# EAGLE schematic Paperduino (EAGLE 7.2.0)
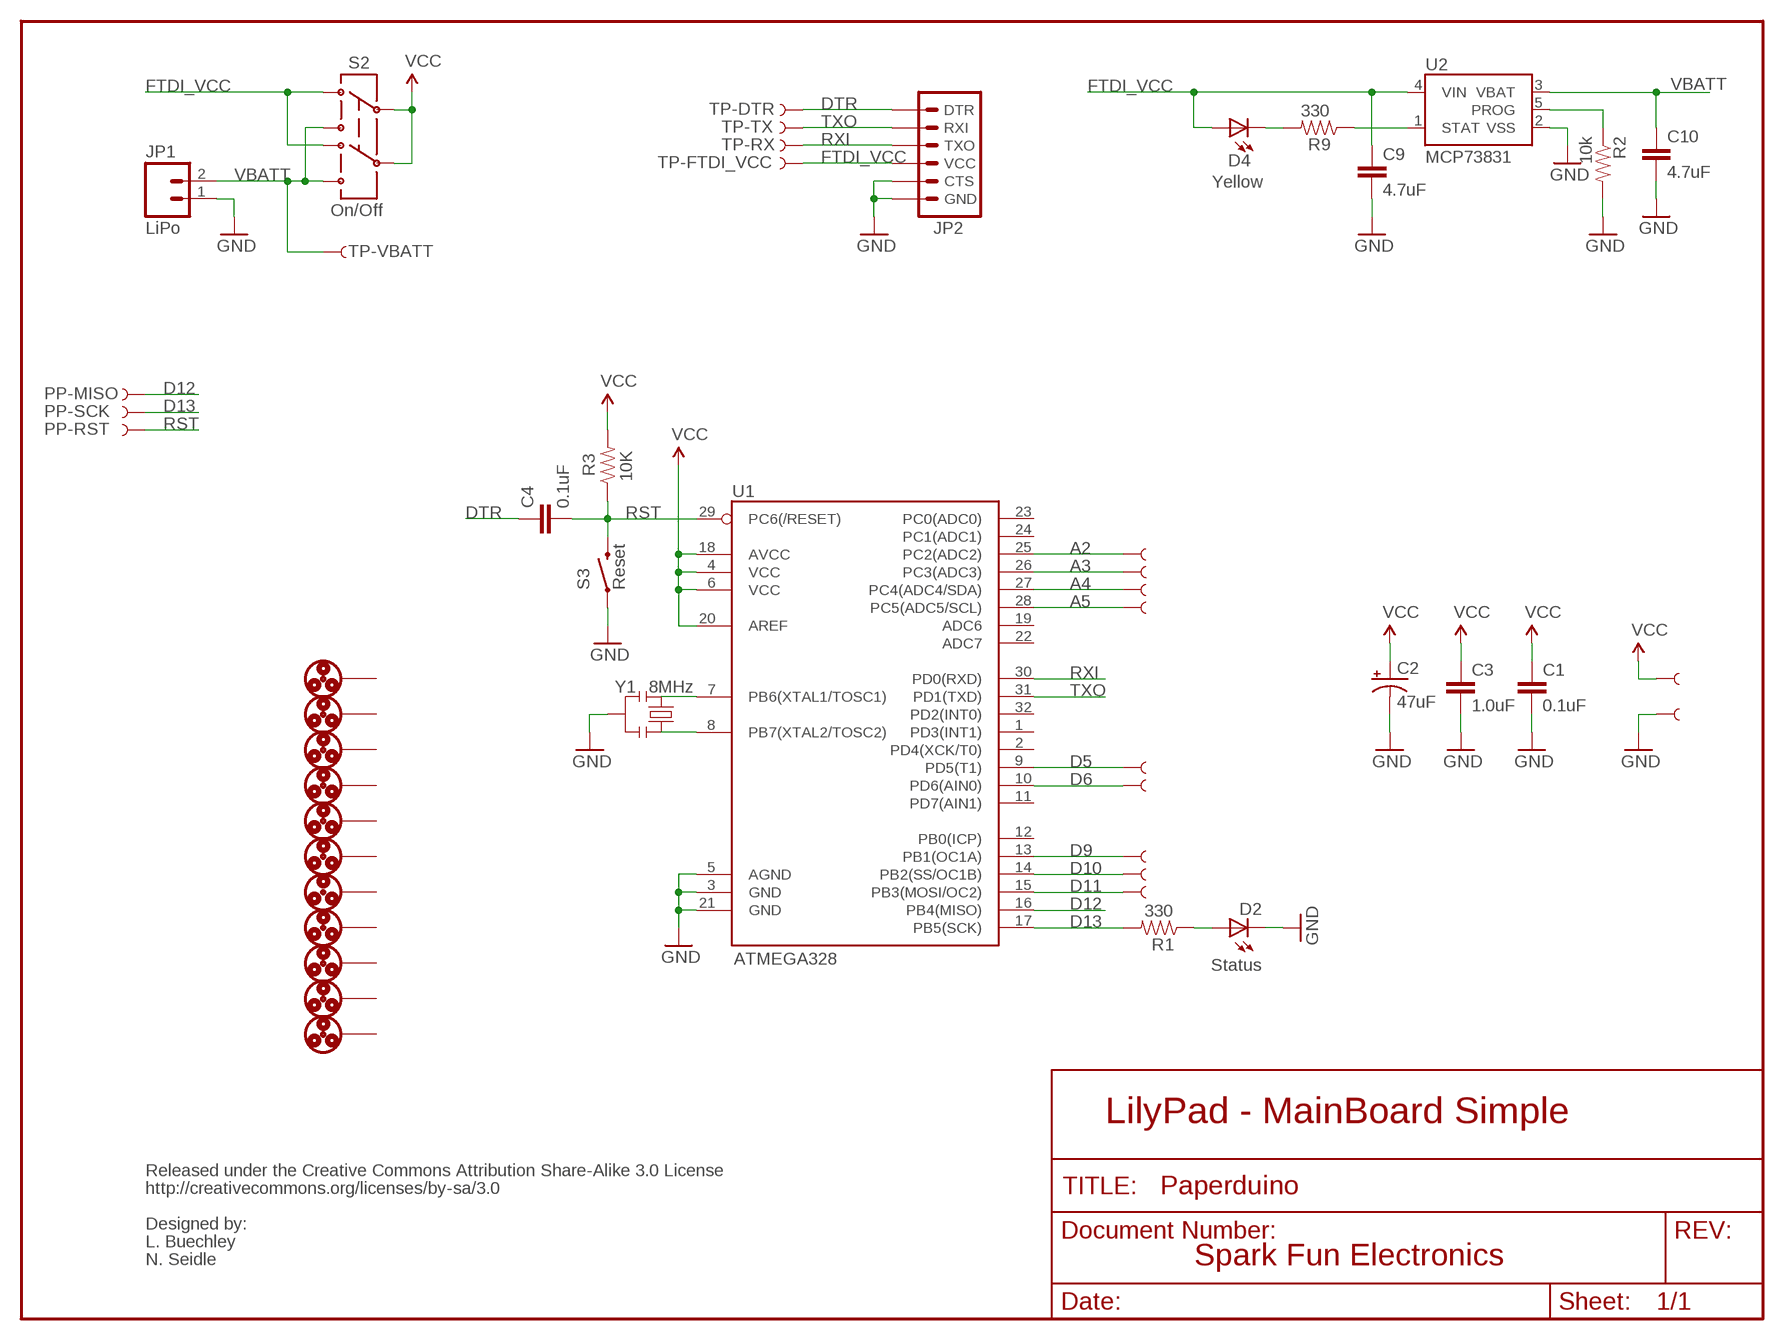
[diagram p0: schematic, sheet 1]

## Parts
A2/16  SEWTAP9  [PETAL-LONG-1-2SIDE]
A3/17  SEWTAP9  [PETAL-LONG-1-2SIDE]
A4/18  SEWTAP9  [PETAL-LONG-1-2SIDE]
A5/19  SEWTAP9  [PETAL-LONG-1-2SIDE]
C1  0.1uF  CAP0402-CAP  [0402-CAP]
C2  47uF  CAP_POL3528  [EIA3528]
C3  1.0uF  CAP0402-CAP  [0402-CAP]
C4  0.1uF  CAP0402-CAP  [0402-CAP]
C9  4.7uF  CAP0402-CAP  [0402-CAP]
C10  4.7uF  CAP0402-CAP  [0402-CAP]
D2  Status  LED0603  [LED-0603]
D4  Yellow  LED0603  [LED-0603]
JP1  LiPo  M02-JST-2MM-SMT  [JST-2-SMD]
JP2  ARDUINO_SERIAL_PROGRAMSMD  [1X06-SMD]
PP-MISO  TEST-POINT3X5  [PAD.03X.05]
PP-RST  TEST-POINT3X5  [PAD.03X.05]
PP-SCK  TEST-POINT3X5  [PAD.03X.05]
R1  330  RESISTOR0402-RES  [0402-RES]
R2  10k  RESISTOR0402-RES  [0402-RES]
R3  10K  RESISTOR0402-RES  [0402-RES]
R9  330  RESISTOR0402-RES  [0402-RES]
S2  On/Off  AYZ0202  [AYZ0202]
S3  Reset  SWITCH-MOMENTARY-2SMD  [TACTILE_SWITCH_SMD]
TP-DTR  TEST-POINT3X5  [PAD.03X.05]
TP-FTDI_VCC  TEST-POINT3X5  [PAD.03X.05]
TP-RX  TEST-POINT3X5  [PAD.03X.05]
TP-TX  TEST-POINT3X5  [PAD.03X.05]
TP-VBATT  TEST-POINT3X5  [PAD.03X.05]
U1  ATMEGA328  ATMEGA168  [TQFP32-08]
U2  MCP73831  [SOT23-5]
U$1  ROUND-12MM-FOOT-1.8MM  [ROUND-12MM-FOOT]
U$2  ROUND-12MM-FOOT-1.8MM  [ROUND-12MM-FOOT]
U$3  ROUND-12MM-FOOT-1.8MM  [ROUND-12MM-FOOT]
U$4  SEWTAP9  [PETAL-LONG-1-2SIDE]
U$5  ROUND-12MM-FOOT-1.8MM  [ROUND-12MM-FOOT]
U$6  ROUND-12MM-FOOT-1.8MM  [ROUND-12MM-FOOT]
U$7  ROUND-12MM-FOOT-1.8MM  [ROUND-12MM-FOOT]
U$8  ROUND-12MM-FOOT-1.8MM  [ROUND-12MM-FOOT]
U$9  ROUND-12MM-FOOT-1.8MM  [ROUND-12MM-FOOT]
U$10  ROUND-12MM-FOOT-1.8MM  [ROUND-12MM-FOOT]
U$11  ROUND-12MM-FOOT-1.8MM  [ROUND-12MM-FOOT]
U$12  ROUND-12MM-FOOT-1.8MM  [ROUND-12MM-FOOT]
U$35  SEWTAP9  [PETAL-LONG-1-2SIDE]
U$37  SEWTAP9  [PETAL-LONG-1-2SIDE]
U$39  SEWTAP9  [PETAL-LONG-1-2SIDE]
U$41  SEWTAP9  [PETAL-LONG-1-2SIDE]
U$43  SEWTAP9  [PETAL-LONG-1-2SIDE]
U$45  SEWTAP9  [PETAL-LONG-1-2SIDE]
Y1  8MHz  RESONATORSMD  [RESONATOR-SMD]

## Nets
A2: A2/16.1 U1.25(PC2(ADC2))
A3: A3/17.1 U1.26(PC3(ADC3))
A4: A4/18.1 U1.27(PC4(ADC4/SDA))
A5: A5/19.1 U1.28(PC5(ADC5/SCL))
D5: U1.9(PD5(T1)) U$41.1
D6: U1.10(PD6(AIN0)) U$35.1
D9: U1.13(PB1(OC1A)) U$37.1
D10: U1.14(PB2(SS/OC1B)) U$39.1
D11: U1.15(PB3(MOSI/OC2)) U$4.1
D12: PP-MISO.P$1 U1.16(PB4(MISO))
D13: PP-SCK.P$1 R1.2 U1.17(PB5(SCK))
DTR: C4.1 JP2.1(DTR) TP-DTR.P$1
FTDI_VCC: C9.1 D4.A JP2.4(VCC) S2.3 S2.6 TP-FTDI_VCC.P$1 U2.4(VIN)
GND [VCC]: C1.2 C2.C(-) C3.2 C9.2 C10.2 D2.C JP1.1 JP2.5(CTS) JP2.6(GND) R2.2 S3.1 U1.3(GND) U1.5(AGND) U1.21(GND) U2.2(VSS) U$43.1 Y1.2
N$1: U1.7(PB6(XTAL1/TOSC1)) Y1.1
N$2: D2.A R1.1
N$3: U1.8(PB7(XTAL2/TOSC2)) Y1.3
N$8: D4.C R9.2
PROG: R2.1 U2.5(PROG)
RST: C4.2 PP-RST.P$1 R3.1 S3.3 U1.29(PC6(/RESET))
RXI: JP2.3(TXO) TP-RX.P$1 U1.30(PD0(RXD))
STAT: R9.1 U2.1(STAT)
TXO: JP2.2(RXI) TP-TX.P$1 U1.31(PD1(TXD))
VBATT: C10.1 JP1.2 S2.1 S2.4 TP-VBATT.P$1 U2.3(VBAT)
VCC [VCC]: C1.1 C2.A(+) C3.1 R3.2 S2.2 S2.5 U1.4(VCC) U1.6(VCC) U1.18(AVCC) U1.20(AREF) U$45.1
Unconnected: U1.1(PD3(INT1)) U1.2(PD4(XCK/T0)) U1.11(PD7(AIN1)) U1.12(PB0(ICP)) U1.19(ADC6) U1.22(ADC7) U1.23(PC0(ADC0)) U1.24(PC1(ADC1)) U1.32(PD2(INT0)) U$1.P$1 U$1.P$2 U$1.P$3 U$1.P$4 U$1.P$5 U$2.P$1 U$2.P$2 U$2.P$3 U$2.P$4 U$2.P$5 U$3.P$1 U$3.P$2 U$3.P$3 U$3.P$4 U$3.P$5 U$5.P$1 U$5.P$2 U$5.P$3 U$5.P$4 U$5.P$5 U$6.P$1 U$6.P$2 U$6.P$3 U$6.P$4 U$6.P$5 U$7.P$1 U$7.P$2 U$7.P$3 U$7.P$4 U$7.P$5 U$8.P$1 U$8.P$2 U$8.P$3 U$8.P$4 U$8.P$5 U$9.P$1 U$9.P$2 U$9.P$3 U$9.P$4 U$9.P$5 U$10.P$1 U$10.P$2 U$10.P$3 U$10.P$4 U$10.P$5 U$11.P$1 U$11.P$2 U$11.P$3 U$11.P$4 U$11.P$5 U$12.P$1 U$12.P$2 U$12.P$3 U$12.P$4 U$12.P$5

## Notes on the sheet
- LilyPad - MainBoard Simple
- Released under the Creative Commons Attribution Share-Alike 3.0 License
- http://creativecommons.org/licenses/by-sa/3.0
- Designed by:
- L. Buechley
- N. Seidle | Spark Fun Electronics

## Library data of the parts
A2/16 A3/17 A4/18 A5/19 U$4 U$35 U$37 U$39 U$41 U$43 U$45 = LilyPad-Wearables:SEWTAP
C1 C3 C4 C9 C10 = SparkFun:CAP: Capacitor Standard 0603 ceramic capacitor, and 0.1" leaded capacitor.
C2 = SparkFun:CAP_POL: Capacitor Polarized These are standard SMD and PTH capacitors. Normally 10uF, 47uF, and 100uF in electrolytic and tantalum varieties. Always verify the external diameter of the through hole cap, it varies with capacity, voltage, and manufacturer. The EIA devices should be standard.
D2 D4 = SparkFun:LED: LEDs Standard schematic elements and footprints for 5mm, 3mm, 1206, and 0603 sized LEDs. 5mm - Spark Fun Electronics SKU : COM-00529 (and others)
JP1 = SparkFun:M02: Header 2 Standard 2-pin 0.1" header. Use with straight break away headers (SKU : PRT-00116), right angle break away headers (PRT-00553), swiss pins (PRT-00743), machine pins (PRT-00117), and female headers (PRT-00115). Molex polarized connector foot print use with SKU : PRT-08233 with associated crimp pins and housings.
JP2 = SparkFun:ARDUINO_SERIAL_PROGRAM
PP-MISO PP-RST PP-SCK TP-DTR TP-FTDI_VCC TP-RX TP-TX TP-VBATT = SparkFun:TEST-POINT
R1-R3 R9 = SparkFun:RESISTOR: Resistor Basic schematic elements and footprints for 0603, 1206, and PTH resistors.
S2 = SparkFun:AYZ0202: SPDT Slide Switch Simple SMD single-pull double-throw slide switch. Good for less than 350mA power switch, switching UARTs between devices, etc. Spark Fun Electronics SKU : COM-00597
S3 = SparkFun:SWITCH-MOMENTARY-2
U1 = SparkFun:ATMEGA168
U2 = SparkFun:MCP73831: Microchip's MCP73831 Miniature single cell, fully integrated Li-Ion, Li-polymer charge management controller http://ww1.microchip.com/downloads/en/DeviceDoc/21984a.pdf
U$1-U$3 U$5-U$12 = electroninks:ROUND-12MM-FOOT-1.8MM
Y1 = SparkFun:RESONATOR: Resonator Small SMD resonator. This is the itty bitty 10/20MHz resonators with built in caps. CSTCE10M0G55 and CSTCE20M0V53. Footprint has been reviewed closely but hasn't been tested yet.

## Net classes
0 Default: width 0.203 mm
1 VCC: width 0.254 mm